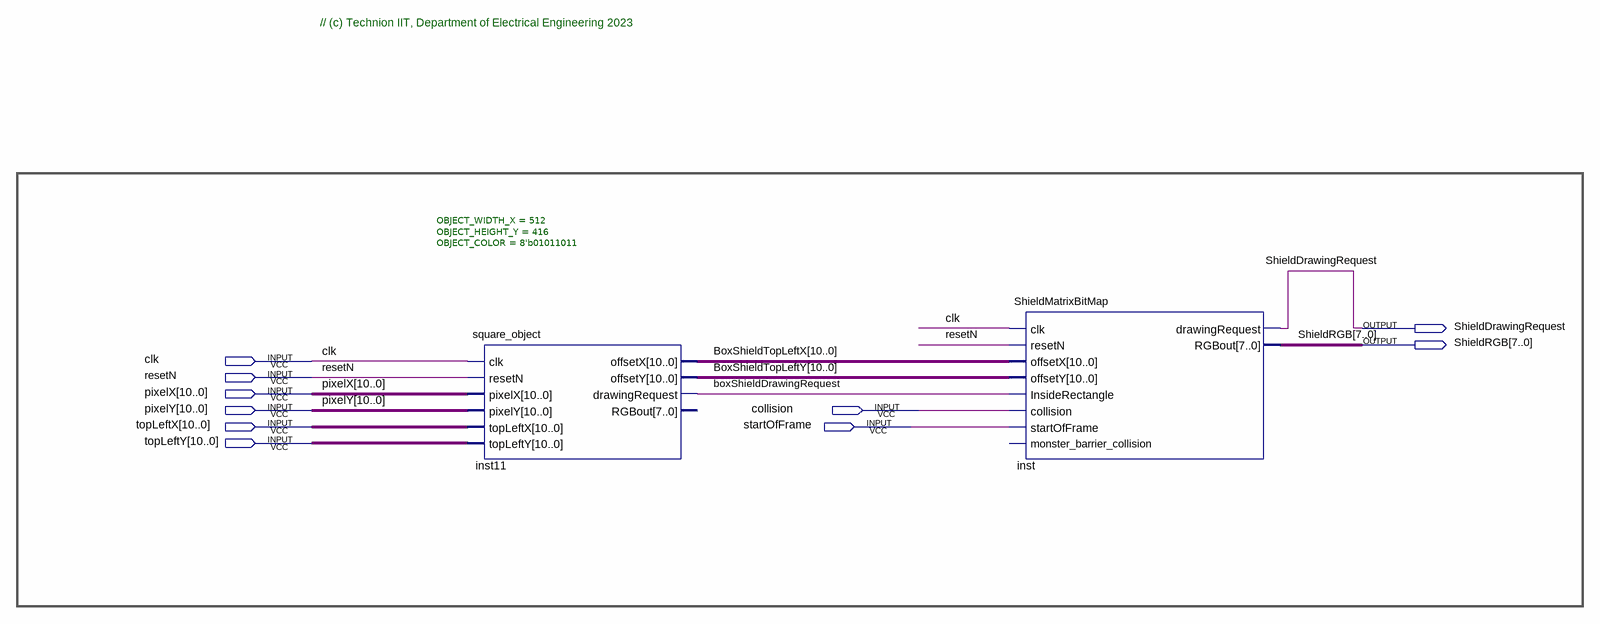
[diagram p0: schematic sheet]
// Quartus schematic SHIELD_DISPLAY.bdf as structural Verilog: 2 symbols, 10 pins
module SHIELD_DISPLAY (
  input  clk,
  input  resetN,
  input  [10:0] pixelX,
  input  [10:0] pixelY,
  input  collision,
  input  [10:0] topLeftX,
  input  startOfFrame,
  input  [10:0] topLeftY,
  output ShieldDrawingRequest,
  output [7:0] ShieldRGB
);

  wire boxShieldDrawingRequest;
  wire [10:0] BoxShieldTopLeftX, BoxShieldTopLeftY;

  square_object #(.OBJECT_WIDTH_X(512), .OBJECT_HEIGHT_Y(416), .OBJECT_COLOR(8'b01011011)) inst11 (
    .clk(clk), .resetN(resetN), .pixelX(pixelX), .pixelY(pixelY), .topLeftX(topLeftX), .topLeftY(topLeftY),
    .offsetX(BoxShieldTopLeftX), .offsetY(BoxShieldTopLeftY), .drawingRequest(boxShieldDrawingRequest));  // open: RGBout
  ShieldMatrixBitMap inst (
    .clk(clk), .resetN(resetN), .offsetX(BoxShieldTopLeftX), .offsetY(BoxShieldTopLeftY),
    .InsideRectangle(boxShieldDrawingRequest), .collision(collision), .startOfFrame(startOfFrame),
    .drawingRequest(ShieldDrawingRequest), .RGBout(ShieldRGB));  // open: monster_barrier_collision

  // Notes on the sheet:
  //   // (c) Technion IIT, Department of Electrical Engineering 2023
endmodule
